# Altium schematic sheet ANALOG_DATA.SchDoc
size B; SheetNumber: 3; SheetTotal: 3
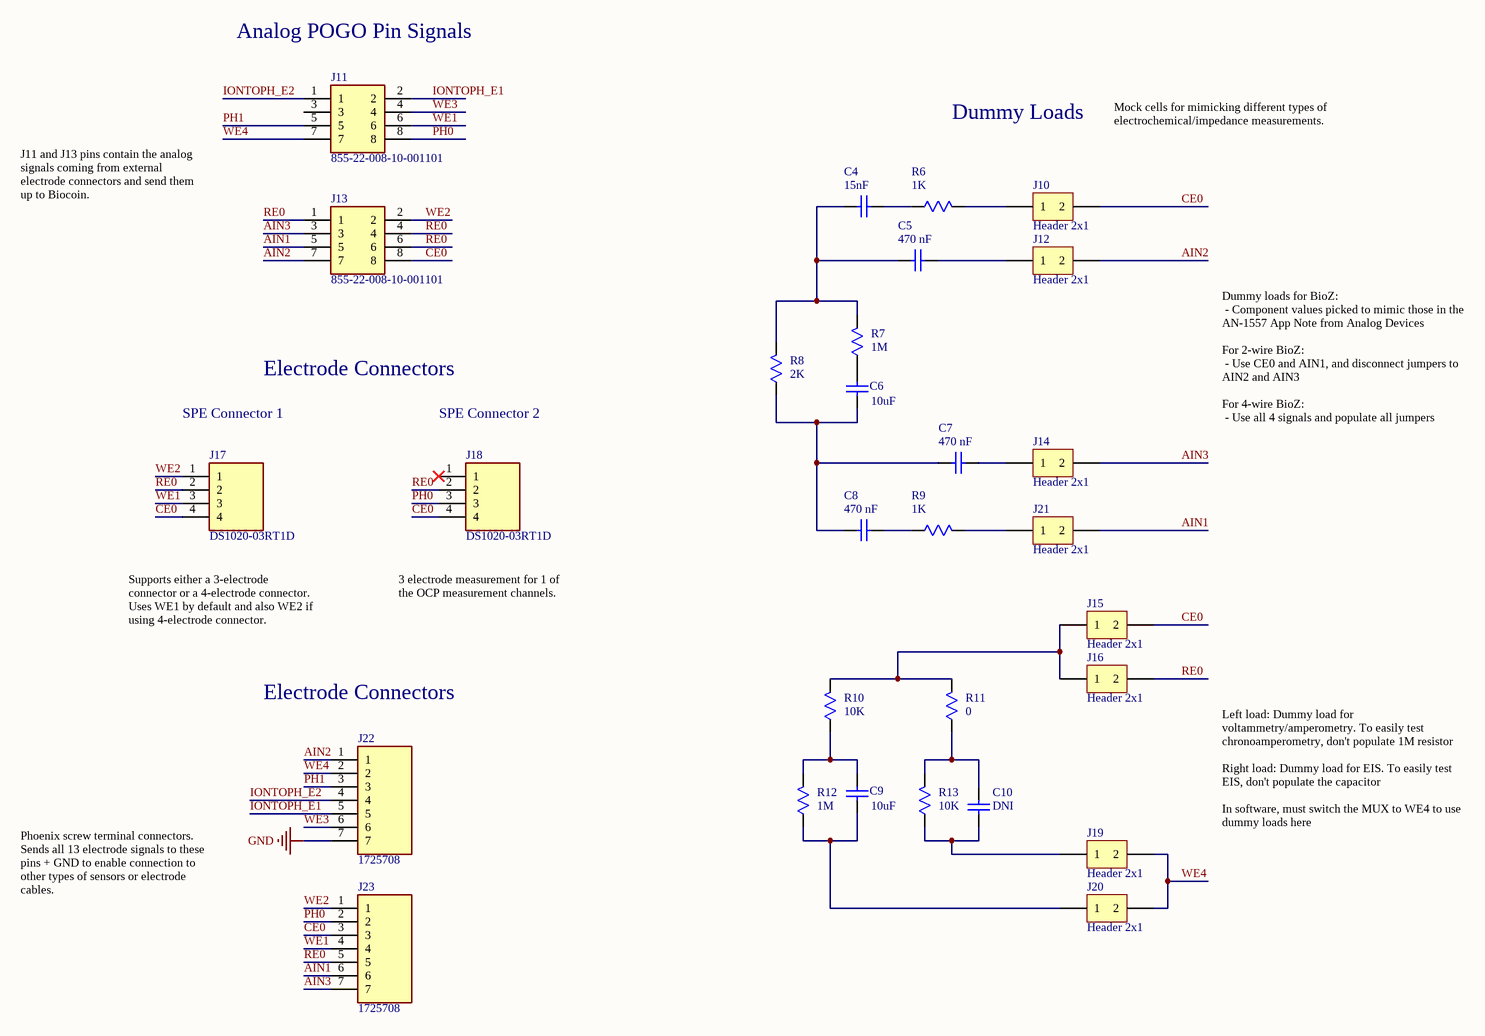
[diagram p0: ANALOG_DATA.SchDoc]

## Parts
C4  value 15nF  [0805-CAP]  (hidden comment: CAP)
C5  value 470 nF  [0805-CAP]  (hidden comment: CAP)
C6  value 10uF  [0805-CAP]  (hidden comment: CAP)
C7  value 470 nF  [0805-CAP]  (hidden comment: CAP)
C8  value 470 nF  [0805-CAP]  (hidden comment: CAP)
C9  value 10uF  [0805-CAP]  (hidden comment: CAP)
C10  value DNI  [0805-CAP]  (hidden comment: CAP)
J10  Header 2x1  [Header 1x2]
J11  855-22-008-10-001101  [8552200810001101]
J12  Header 2x1  [Header 1x2]
J13  855-22-008-10-001101  [8552200810001101]
J14  Header 2x1  [Header 1x2]
J15  Header 2x1  [Header 1x2]
J16  Header 2x1  [Header 1x2]
J17  DS1020-03RT1D  [55203144-2]
J18  DS1020-03RT1D  [55203144-2]
J19  Header 2x1  [Header 1x2]
J20  Header 2x1  [Header 1x2]
J21  Header 2x1  [Header 1x2]
J22  1725708  [1725708]
J23  1725708  [1725708]
R6  value 1K  [0805-RES]  (hidden comment: RES)
R7  value 1M  [0805-RES]  (hidden comment: RES)
R8  value 2K  [0805-RES]  (hidden comment: RES)
R9  value 1K  [0805-RES]  (hidden comment: RES)
R10  value 10K  [0805-RES]  (hidden comment: RES)
R11  value 0  [0805-RES]  (hidden comment: RES)
R12  value 1M  [0805-RES]  (hidden comment: RES)
R13  value 10K  [0805-RES]  (hidden comment: RES)

## Nets
GND: J22.7
AIN1: J13.5 J21.2 J23.6
AIN2: J12.2 J13.7 J22.1
AIN3: J13.3 J14.2 J23.7
CE0: J10.2 J13.8 J15.2 J17.4 J18.4 J23.3
IONTOPH_E1: J11.2 J22.5
IONTOPH_E2: J11.1 J22.4
PH0: J11.8 J18.3 J23.2
PH1: J11.5 J22.3
RE0: J13.1 J13.4 J13.6 J16.2 J17.2 J18.2 J23.5
WE1: J11.6 J17.3 J23.4
WE2: J13.2 J17.1 J23.1
WE3: J11.4 J22.6
WE4: J11.7 J19.2 J20.2 J22.2
NetC4_1: C4.1 C5.1 R7.2 R8.2
NetC4_2: C4.2 R6.1
NetC5_2: C5.2 J12.1
NetC6_1: C6.1 C7.1 C8.1 R8.1
NetC6_2: C6.2 R7.1
NetC7_2: C7.2 J14.1
NetC8_2: C8.2 R9.1
NetC9_1: C9.1 J20.1 R12.1
NetC9_2: C9.2 R10.1 R12.2
NetC10_1: C10.1 J19.1 R13.1
NetC10_2: C10.2 R11.1 R13.2
NetJ10_1: J10.1 R6.2
NetJ15_1: J15.1 J16.1 R10.2 R11.2
NetJ21_1: J21.1 R9.2

Not connected (* = marked no-connect by the designer): J11 3; J18 1*

## Notes on the sheet
- Analog POGO Pin Signals
- Dummy Loads
- Mock cells for mimicking different types of electrochemical/impedance measurements.
- J11 and J13 pins contain the analog signals coming from external electrode connectors and send them up to Biocoin.
- SPE Connector 1
- Electrode Connectors
- SPE Connector 2
- Dummy loads for BioZ:
  - Component values picked to mimic those in the AN-1557 App Note from Analog Devices
  For 2-wire BioZ:
  - Use CE0 and AIN1, and disconnect jumpers to AIN2 and AIN3
  For 4-wire BioZ:
  - Use all 4 signals and populate all jumpers
- Supports either a 3-electrode connector or a 4-electrode connector. Uses WE1 by default and also WE2 if using 4-electrode connector.
- 3 electrode measurement for 1 of the OCP measurement channels.
- Phoenix screw terminal connectors. Sends all 13 electrode signals to these pins + GND to enable connection to other types of sensors or electrode cables.
- Left load: Dummy load for voltammetry/amperometry. To easily test chronoamperometry, don't populate 1M resistor
  Right load: Dummy load for EIS. To easily test EIS, don't populate the capacitor
  In software, must switch the MUX to WE4 to use dummy loads here

## Library data of the parts
C4-C10 = CAP SMD: Multilayer Chip Capacitor; Designer: OMIGA
J10 J12 J14-J16 J19-J21 = Header 2x1: Pin Header 2x1; Designer: OMIGA
J11 J13 = 8 pin Pogo Pin Male Header: Manufacturer_Name: Mill-Max; Datasheet Link: https://componentsearchengine.com/Datasheets/2/855-22-008-10-001101.pdf; Height: 6.27mm; Manufacturer_Part_Number: 855-22-008-10-001101
J17 J18 = SPE Connector 3 pin: 3 pin right angle SPE connector. Can also use the 5-520315-3-ND
J22 J23 = 1725708: Connector; Manufacturer_Name: Phoenix Contact; Datasheet Link: https://www.phoenixcontact.com/online/portal/us/?uri=pxc-oc-itemdetail:pid=1725708&library=usen&pcck=P-11-01-05&tab=1&selectedCategory=ALL; Height: 8.65mm; Manufacturer_Part_Number: 1725708
R6-R13 = RES SMD: Surface Mount Resistor; Designer: OMIGA